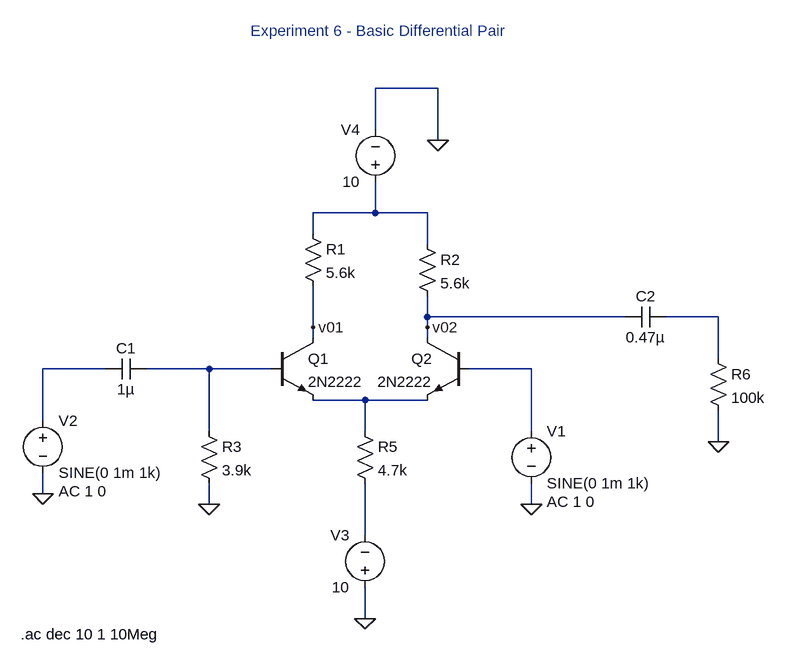
[diagram p0: schematic Experiment 6 - Basic BJT Differential Pair.asc]
Experiment 6 - Basic BJT Differential Pair.asc, the LTspice schematic file:
Version 4
SHEET 1 912 680
WIRE 400 -320 304 -320
WIRE 304 -256 304 -320
WIRE 400 -240 400 -320
WIRE 304 -128 304 -176
WIRE 304 -128 208 -128
WIRE 384 -128 304 -128
WIRE 208 -96 208 -128
WIRE 384 -80 384 -128
WIRE 384 32 384 0
WIRE 688 32 384 32
WIRE 832 32 752 32
WIRE 208 48 208 -16
WIRE 384 48 384 32
WIRE 208 64 208 48
WIRE 384 64 384 48
WIRE 832 96 832 32
WIRE -112 112 -208 112
WIRE 48 112 -48 112
WIRE 144 112 48 112
WIRE 544 112 448 112
WIRE 288 160 208 160
WIRE 384 160 288 160
WIRE -208 192 -208 112
WIRE 48 208 48 112
WIRE 288 208 288 160
WIRE 544 208 544 112
WIRE 832 224 832 176
WIRE -208 304 -208 272
WIRE 48 320 48 288
WIRE 544 320 544 288
WIRE 288 368 288 288
WIRE 288 496 288 448
FLAG -208 304 0
FLAG 48 320 0
FLAG 288 496 0
FLAG 544 320 0
FLAG 832 224 0
FLAG 400 -240 0
FLAG 208 48 v01
FLAG 384 48 v02
SYMBOL npn 144 64 R0
SYMATTR InstName Q1
SYMATTR Value 2N2222
SYMBOL npn 448 64 M0
SYMATTR InstName Q2
SYMATTR Value 2N2222
SYMBOL res 192 -112 R0
SYMATTR InstName R1
SYMATTR Value 5.6k
SYMBOL res 368 -96 R0
SYMATTR InstName R2
SYMATTR Value 5.6k
SYMBOL res 32 192 R0
SYMATTR InstName R3
SYMATTR Value 3.9k
SYMBOL res 272 192 R0
SYMATTR InstName R5
SYMATTR Value 4.7k
SYMBOL cap -48 96 R90
WINDOW 0 0 32 VBottom 2
WINDOW 3 32 32 VTop 2
SYMATTR InstName C1
SYMATTR Value 1µ
SYMBOL cap 752 16 R90
WINDOW 0 0 32 VBottom 2
WINDOW 3 32 32 VTop 2
SYMATTR InstName C2
SYMATTR Value 0.47µ
SYMBOL res 816 80 R0
SYMATTR InstName R6
SYMATTR Value 100k
SYMBOL voltage 544 192 R0
WINDOW 123 24 124 Left 2
WINDOW 39 0 0 Left 0
SYMATTR InstName V1
SYMATTR Value SINE(0 1m 1k)
SYMATTR Value2 AC 1 0
SYMBOL voltage -208 176 R0
WINDOW 123 24 124 Left 2
WINDOW 39 0 0 Left 0
SYMATTR InstName V2
SYMATTR Value SINE(0 1m 1k)
SYMATTR Value2 AC 1 0
SYMBOL voltage 288 464 R180
WINDOW 0 24 96 Left 2
WINDOW 3 24 16 Left 2
WINDOW 123 0 0 Left 0
WINDOW 39 0 0 Left 0
SYMATTR InstName V3
SYMATTR Value 10
SYMBOL voltage 304 -160 R180
WINDOW 0 24 96 Left 2
WINDOW 3 24 16 Left 2
WINDOW 123 0 0 Left 0
WINDOW 39 0 0 Left 0
SYMATTR InstName V4
SYMATTR Value 10
TEXT -242 520 Left 2 !.ac dec 10 1 10Meg
TEXT 112 -408 Left 2 ;Experiment 6 - Basic Differential Pair

The netlist it stands for:
* Experiment 6 - Basic BJT Differential Pair.asc
Q1 v01 N004 N006 0 2N2222
Q2 v02 N005 N006 0 2N2222
R1 N001 v01 5.6k
R2 N001 v02 5.6k
R3 N004 0 3.9k
R5 N006 N007 4.7k
C1 N004 N003 1µ
C2 N002 v02 0.47µ
R6 N002 0 100k
V1 N005 0 SINE(0 1m 1k) AC 1 0
V2 N003 0 SINE(0 1m 1k) AC 1 0
V3 0 N007 10
V4 N001 0 10
.model NPN NPN
.model PNP PNP
.lib standard.bjt
.ac dec 10 1 10Meg
* Experiment 6 - Basic Differential Pair
.backanno
.end

* Results of the author's LTspice run, read from the files saved beside the schematic
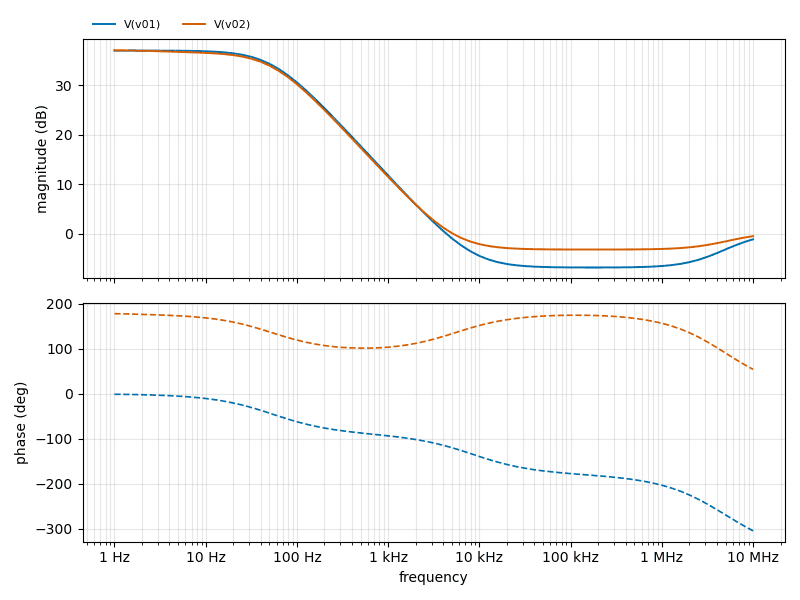
[diagram p1: AC Analysis of Experiment 6 - Basic BJT Differential Pair.asc, plotted from the saved traces]
* AC Analysis, 1 run:
*   V(v01): 37.05 dB at 1 Hz, -1.16 dB at 10 MHz, peak 37.05 dB at 1 Hz, 3 dB below the peak at 53.92 Hz
*   V(v02): 37.11 dB at 1 Hz, -0.51 dB at 10 MHz, peak 37.11 dB at 1 Hz, 3 dB below the peak at 48.7 Hz